# Altium project altimeter.PrjPcb
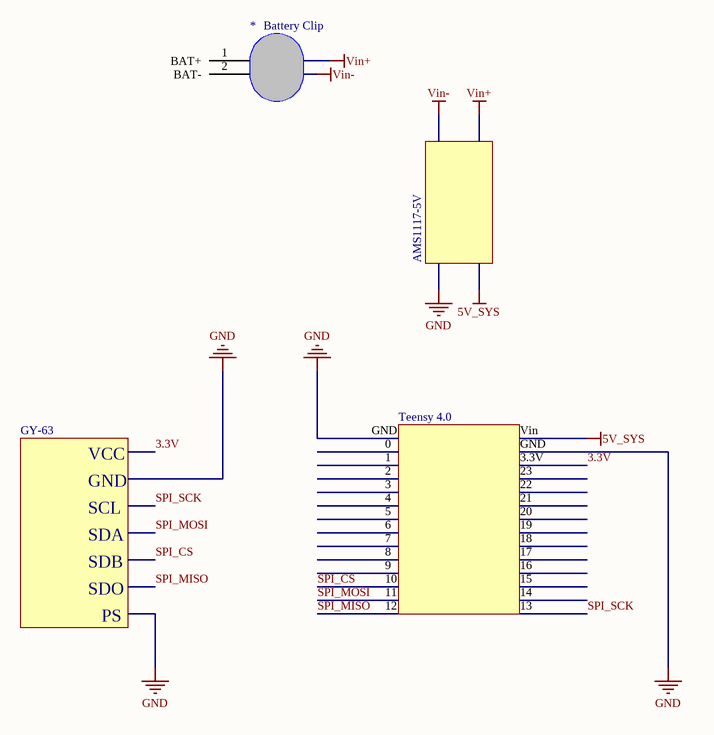
[diagram p0: Sheet2.SchDoc]
1 sheet, 1 parts. Net scope: global (net labels, ports and power ports of the same name join across sheets).

## Sheet Sheet2.SchDoc
size A; SheetNumber: 1; SheetTotal: 1

### Parts
*  Battery Clip

### Nets

Not connected (* = marked no-connect by the designer): * 1(BAT+) 2(BAT-)

### Notes on the sheet
- AMS1117-5V
- GY-63
- VCC
- GND
- 2
- 1
- 0
- Teensy 4.0
- 23
- Vin
- 3.3V
- SCL
- SDA
- 7
- 6
- 5
- 4
- 3
- 18
- 19
- 20
- 21
- 22
- SDB
- SDO
- 12
- 11
- 10
- 9
- 8
- 13
- 14
- 15
- 16
- 17
- PS

### Library data of the parts
* = Component_1